# Altium schematic sheet STM32F407VG-D.SchDoc
size A4
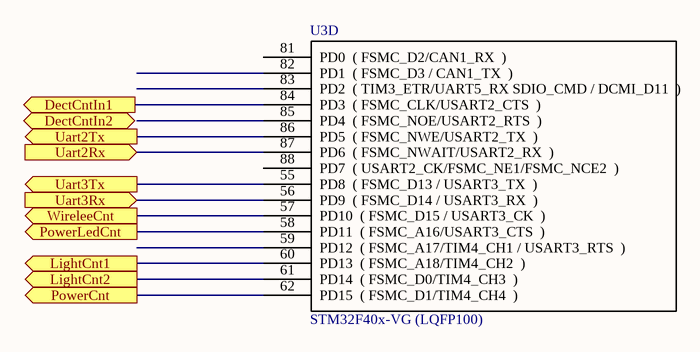
[diagram p0: STM32F407VG-D.SchDoc]

## Parts
U3  STM32F40x-VG (LQFP100)  [LQFP100_N]  (part D of 6)

## Ports
DectCntIn1 (out), DectCntIn2 (out), LightCnt1 (out), LightCnt2 (out), PowerCnt (out), PowerLedCnt (out), Uart2Rx (in), Uart2Tx (out), Uart3Rx (in), Uart3Tx (out), WireleeCnt (out)

## Nets
DectCntIn1: U3.84(PD3__(_FSMC_CLK/USART2_CTS__)) ; port DectCntIn1
LightCnt1: U3.60(PD13__(_FSMC_A18/TIM4_CH2__)) ; port LightCnt1
LightCnt2: U3.61(PD14__(_FSMC_D0/TIM4_CH3__)) ; port LightCnt2
PowerCnt: U3.62(PD15__(_FSMC_D1/TIM4_CH4__)) ; port PowerCnt
PowerLedCnt: U3.58(PD11__(_FSMC_A16/USART3_CTS__)) ; port PowerLedCnt
Uart2Rx: U3.87(PD6__(_FSMC_NWAIT/USART2_RX__)) ; port Uart2Rx
Uart2Tx: U3.86(PD5__(_FSMC_NWE/USART2_TX__)) ; port Uart2Tx
Uart3Rx: U3.56(PD9__(_FSMC_D14_/_USART3_RX__)) ; port Uart3Rx
Uart3Tx: U3.55(PD8__(_FSMC_D13_/_USART3_TX__)) ; port Uart3Tx
WireleeCnt: U3.57(PD10__(_FSMC_D15_/_USART3_CK__)) ; port WireleeCnt

Not connected (* = marked no-connect by the designer): U3 59(PD12__(_FSMC_A17/TIM4_CH1_/_USART3_RTS__)) 81(PD0__(_FSMC_D2/CAN1_RX__)) 82(PD1__(_FSMC_D3_/_CAN1_TX__)) 83(PD2__(_TIM3_ETR/UART5_RX_SDIO_CMD_/_DCMI_D11__)) 85(PD4__(_FSMC_NOE/USART2_RTS__)) 88(PD7__(_USART2_CK/FSMC_NE1/FSMC_NCE2__))

## Library data of the parts
U3 = STM32F40x-VG